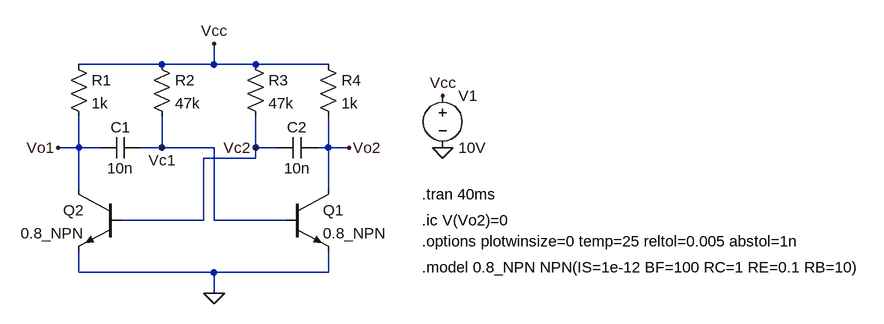
[diagram p0: schematic Bjt_Astable_Multivibrator_Schematic.asc]
Bjt_Astable_Multivibrator_Schematic.asc, the LTspice schematic file:
Version 4.1
SHEET 1 1344 696
WIRE 160 64 32 64
WIRE 240 64 240 32
WIRE 240 64 160 64
WIRE 304 64 240 64
WIRE 416 64 304 64
WIRE 32 192 32 144
WIRE 32 192 0 192
WIRE 64 192 32 192
WIRE 160 192 160 144
WIRE 160 192 128 192
WIRE 240 192 160 192
WIRE 304 192 304 144
WIRE 336 192 304 192
WIRE 416 192 416 144
WIRE 416 192 400 192
WIRE 448 192 416 192
WIRE 304 208 304 192
WIRE 304 208 224 208
WIRE 32 256 32 192
WIRE 416 256 416 192
WIRE 224 304 224 208
WIRE 224 304 96 304
WIRE 240 304 240 192
WIRE 352 304 240 304
WIRE 32 384 32 352
WIRE 240 384 32 384
WIRE 416 384 416 352
WIRE 416 384 240 384
WIRE 240 416 240 384
FLAG 240 416 0
FLAG 592 192 0
FLAG 592 112 Vcc
FLAG 240 32 Vcc
FLAG 448 192 Vo2
FLAG 0 192 Vo1
FLAG 160 192 Vc1
FLAG 304 192 Vc2
SYMBOL res 16 48 R0
SYMATTR InstName R1
SYMATTR Value 1k
SYMBOL res 144 48 R0
SYMATTR InstName R2
SYMATTR Value 47k
SYMBOL res 288 48 R0
SYMATTR InstName R3
SYMATTR Value 47k
SYMBOL res 400 48 R0
SYMATTR InstName R4
SYMATTR Value 1k
SYMBOL cap 128 176 R90
WINDOW 0 0 32 VBottom 2
WINDOW 3 32 32 VTop 2
SYMATTR InstName C1
SYMATTR Value 10n
SYMBOL cap 400 176 R90
WINDOW 0 0 32 VBottom 2
WINDOW 3 32 32 VTop 2
SYMATTR InstName C2
SYMATTR Value 10n
SYMBOL npn 352 256 R0
SYMATTR InstName Q1
SYMATTR Value 0.8_NPN
SYMBOL npn 96 256 M0
SYMATTR InstName Q2
SYMATTR Value 0.8_NPN
SYMBOL voltage 592 96 R0
WINDOW 123 0 0 Left 0
WINDOW 39 0 0 Left 0
SYMATTR InstName V1
SYMATTR Value 10V
TEXT 560 304 Left 2 !.ic V(Vo2)=0
TEXT 560 336 Left 2 !.options plotwinsize=0 temp=25 reltol=0.005 abstol=1n
TEXT 560 264 Left 2 !.tran 40ms
TEXT 560 376 Left 2 !.model 0.8_NPN NPN(IS=1e-12 BF=100 RC=1 RE=0.1 RB=10)

The netlist it stands for:
* Bjt_Astable_Multivibrator_Schematic.asc
R1 Vcc Vo1 1k
R2 Vcc Vc1 47k
R3 Vcc Vc2 47k
R4 Vcc Vo2 1k
C1 Vc1 Vo1 10n
C2 Vo2 Vc2 10n
Q1 Vo2 Vc1 0 0 0.8_NPN
Q2 Vo1 Vc2 0 0 0.8_NPN
V1 Vcc 0 10V
.model NPN NPN
.model PNP PNP
.lib standard.bjt
.ic V(Vo2)=0
.options plotwinsize=0 temp=25 reltol=0.005 abstol=1n
.tran 40ms
.model 0.8_NPN NPN(IS=1e-12 BF=100 RC=1 RE=0.1 RB=10)
.backanno
.end